# EAGLE design chlorophyll_analyzer_attachment (EAGLE 9.4.2)
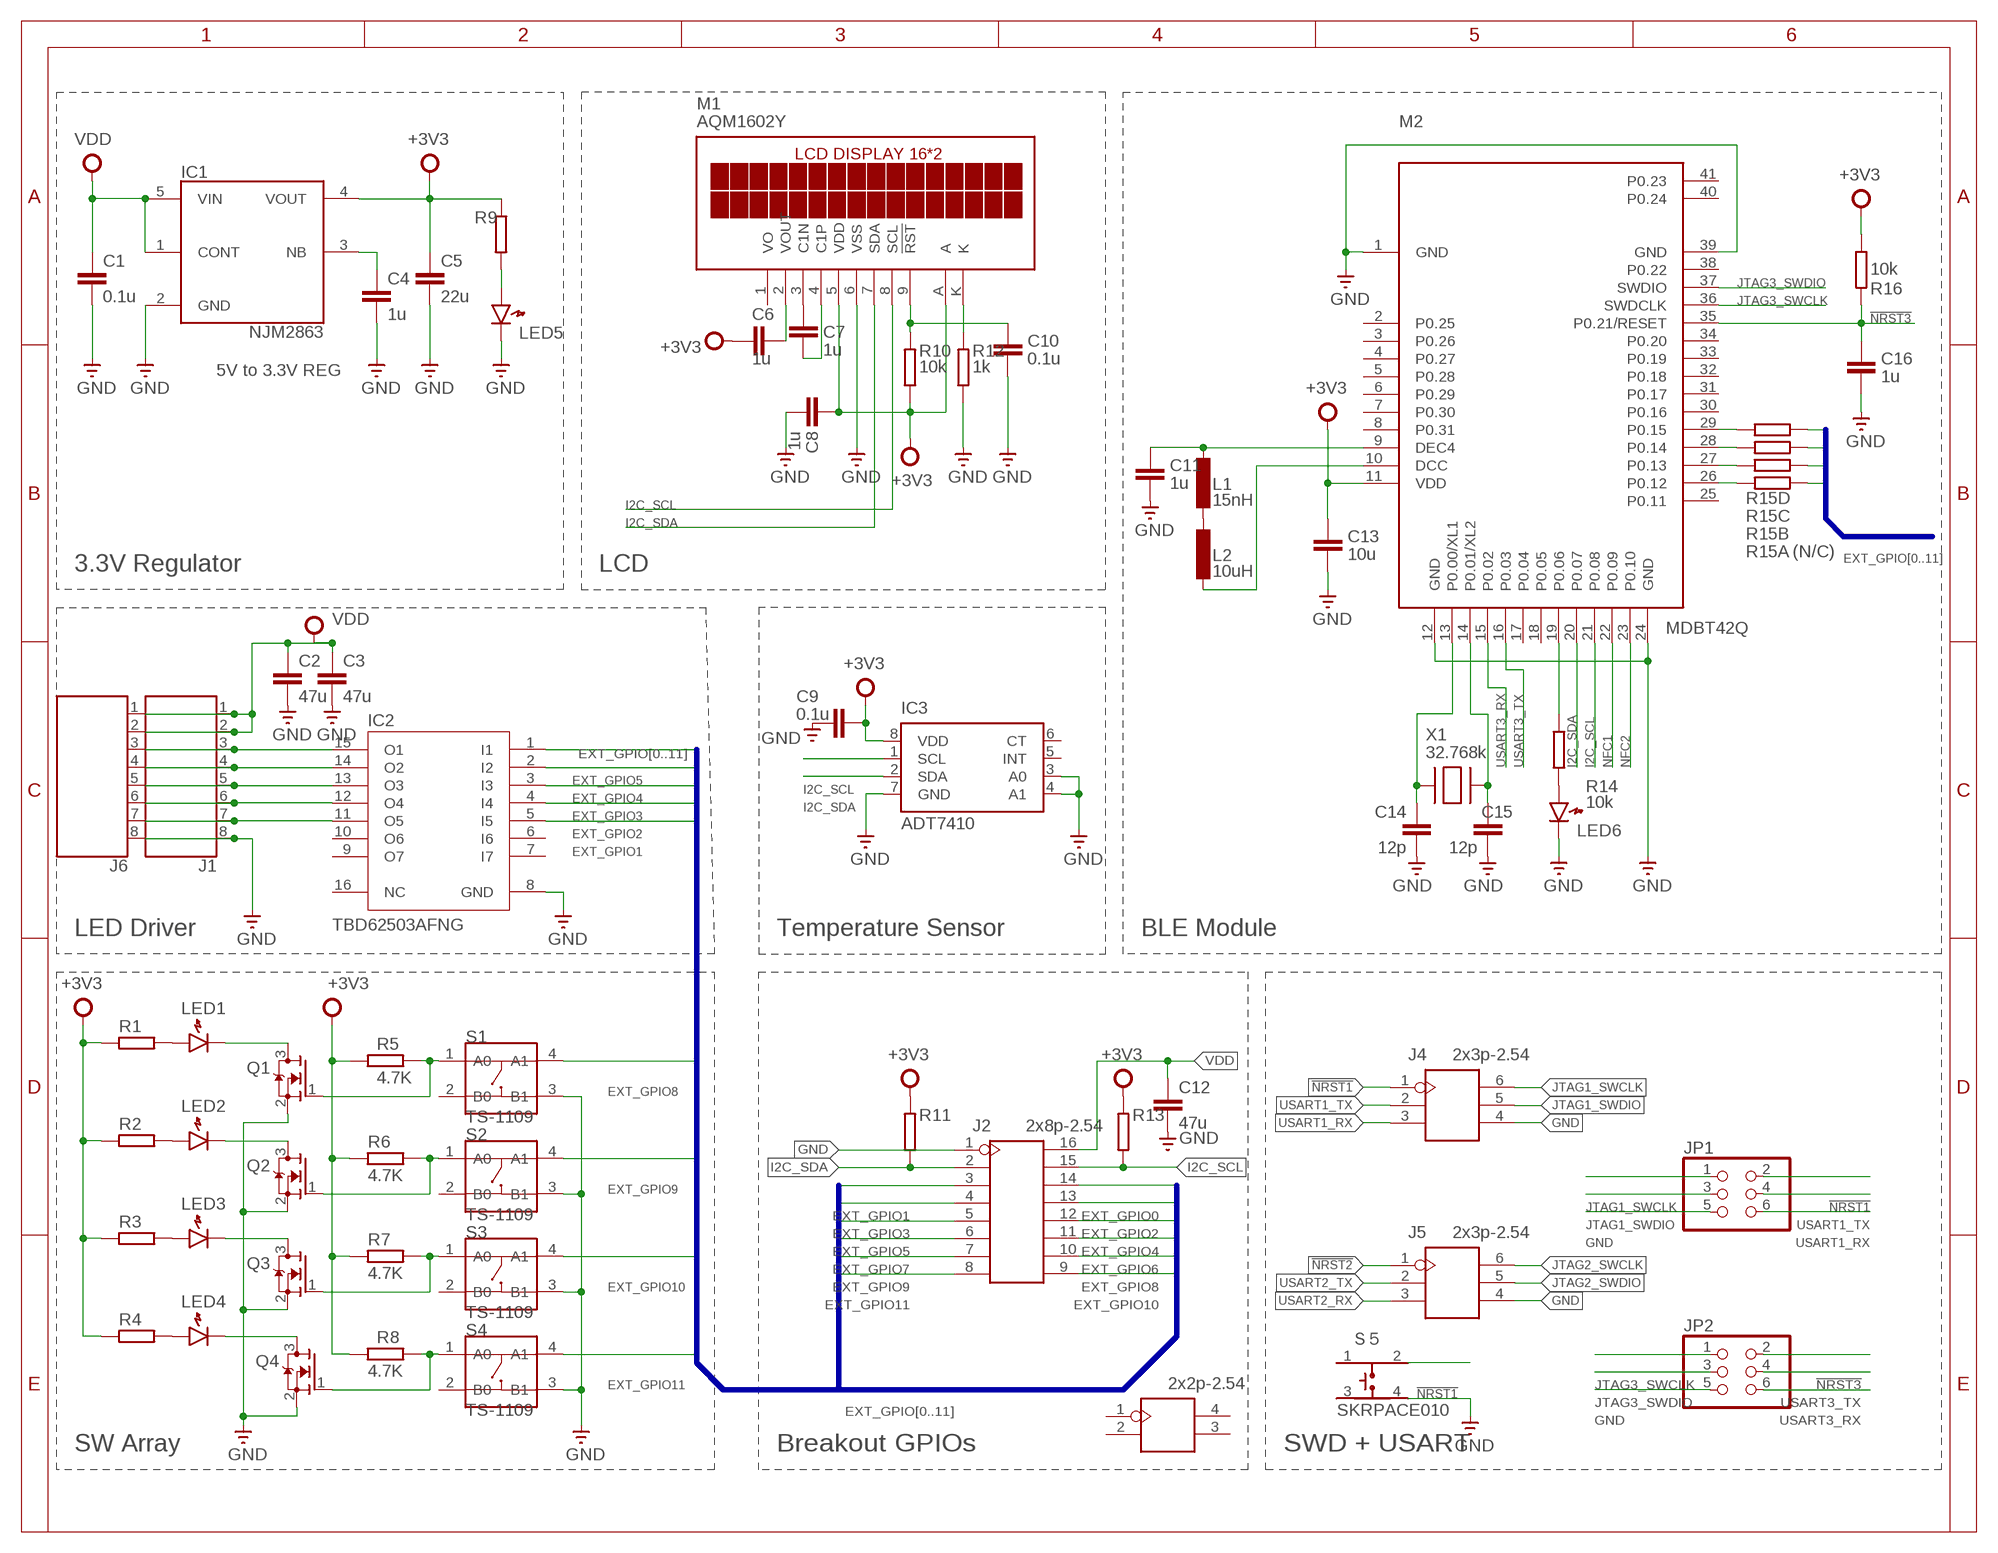
[diagram p0: schematic, sheet 1]

## Parts
C1  0.1u  C-EUC0603K  [C0603K]
C2  47u  C-EUC1206  [C1206]
C3  47u  C-EUC1206  [C1206]
C4  1u  C-EUC0603K  [C0603K]
C5  22u  C-EUC0603K  [C0603K]
C6  1u  C-EUC0603K  [C0603K]
C7  1u  C-EUC0603K  [C0603K]
C8  1u  C-EUC0603K  [C0603K]
C9  0.1u  C-EUC0603K  [C0603K]
C10  0.1u  C-EUC0603K  [C0603K]
C11  1u  C-EUC0603K  [C0603K]
C12  47u  C-EUC1206  [C1206]
C13  10u  C-EUC0603K  [C0603K]
C14  12p  C-EUC0603K  [C0603K]
C15  12p  C-EUC0603K  [C0603K]
C16  1u  C-EUC0603K  [C0603K]
IC1  NJM2863  [SOT-23-5]
IC2  TBD62503AFNG  [SSOP16-P-225-0.65B]
IC3  ADT7410  [SOIC8]
J1  687108183722  [687108183722]
J2  2x8p-2.54  DIP-BLACK-FEMALE-HEADER-VERT(2X8P-2.54)  [H2X8-2.54]
J3  2x2p-2.54  DIP-BLACK-FEMALE-HEADER-VERT(2X2P-2.54)  [H2X2-2.54]
J4  2x3p-2.54  DIP-BLACK-FEMALE-HEADER-VERT(2X3P-2.54)  [H2X3-2.54]
J5  2x3p-2.54  DIP-BLACK-FEMALE-HEADER-VERT(2X3P-2.54)  [H2X3-2.54]
J6  687108183722  [687108183722]
JP1  PINHD-2X3  [2X03]
JP2  PINHD-2X3  [2X03]
L1  15nH  INDUCOR1608  [SMD1608]
L2  10uH  INDUCOR1608  [SMD1608]
LED1  LED1608  [LED1608]
LED2  LED1608  [LED1608]
LED3  LED1608  [LED1608]
LED4  LED1608  [LED1608]
LED5  LED1608  [LED1608]
LED6  LED1608  [LED1608]
M1  AQM1602Y  [AQM1602Y]
M2  MDBT42Q  [MDBT42Q]
Q1  MOSFET-NREFLOW  [SOT23]
Q2  MOSFET-NREFLOW  [SOT23]
Q3  MOSFET-NREFLOW  [SOT23]
Q4  MOSFET-NREFLOW  [SOT23]
R1  RESISTOR1608  [SMD1608]
R2  RESISTOR1608  [SMD1608]
R3  RESISTOR1608  [SMD1608]
R4  RESISTOR1608  [SMD1608]
R5  4.7K  RESISTOR1608  [SMD1608]
R6  4.7K  RESISTOR1608  [SMD1608]
R7  4.7K  RESISTOR1608  [SMD1608]
R8  4.7K  RESISTOR1608  [SMD1608]
R9  RESISTOR1608  [SMD1608]
R10  10k  RESISTOR1608  [SMD1608]
R11  RESISTOR1608  [SMD1608]
R12  1k  RESISTOR1608  [SMD1608]
R13  RESISTOR1608  [SMD1608]
R14  10k  RESISTOR1608  [SMD1608]
R15  (N/C)  RESISTOR_ARRY1206  [RESCAXS80P320X160X60-8N]
R16  10k  RESISTOR1608  [SMD1608]
S1  TS-1109  DIP-BUTTON-4P  [SW4-6.0X6.0X5.0MM]
S2  TS-1109  DIP-BUTTON-4P  [SW4-6.0X6.0X5.0MM]
S3  TS-1109  DIP-BUTTON-4P  [SW4-6.0X6.0X5.0MM]
S4  TS-1109  DIP-BUTTON-4P  [SW4-6.0X6.0X5.0MM]
S５  SKRPACE010  [SW_SKRPACE010]
X1  32.768k  XTAL-3.2X1.5  [XTAL3215]

## Nets
!NRST1: J4.1 JP1.2 S５.2
!NRST2: J5.1
!NRST3: C16.1 JP2.2 M2.35(P0.21/RESET) R16.1
+3V3: C5.1 C6.1 C8.2 C9.1 C13.1 IC1.4(VOUT) IC3.8(VDD) M1.5(VDD) M1.A M2.11(VDD) R1.1 R2.1 R3.1 R4.1 R5.1 R6.1 R7.1 R8.1 R9.1 R10.2 R11.1 R13.1 R16.2
EXT_GPIO0: J2.14
EXT_GPIO1: IC2.5(I5) J2.3
EXT_GPIO2: IC2.4(I4) J2.13
EXT_GPIO3: IC2.3(I3) J2.4
EXT_GPIO4: IC2.2(I2) J2.12
EXT_GPIO5: IC2.1(I1) J2.5
EXT_GPIO6: J2.11
EXT_GPIO7: J2.6
EXT_GPIO8: J2.10 R15.8 S1.4(A1)
EXT_GPIO9: J2.7 R15.7 S2.4(A1)
EXT_GPIO10: J2.9 R15.6 S3.4(A1)
EXT_GPIO11: J2.8 R15.5 S4.4(A1)
GND: C1.2 C2.2 C3.2 C4.2 C5.2 C8.1 C9.2 C10.2 C11.2 C12.2 C13.2 C14.2 C15.2 C16.2 IC1.2(GND) IC2.8(GND) IC3.3(A0) IC3.4(A1) IC3.7(GND) J1.8 J2.1 J4.4 J5.4 J6.8 JP1.5 JP2.5 LED5.K LED6.K M1.6(VSS) M2.1(GND) M2.12(GND) M2.24(GND) M2.39(GND) Q1.2(S) Q2.2(S) Q3.2(S) Q4.2(S) R12.2 S1.3(B1) S2.3(B1) S3.3(B1) S4.3(B1) S５.4
I2C_SCL: IC3.1(SCL) J2.15 M1.8(SCL) M2.21(P0.08) R13.2
I2C_SDA: IC3.2(SDA) J2.2 M1.7(SDA) M2.20(P0.07) R11.2
JTAG1_SWCLK: J4.6 JP1.1
JTAG1_SWDIO: J4.5 JP1.3
JTAG2_SWCLK: J5.6
JTAG2_SWDIO: J5.5
JTAG3_SWCLK: JP2.1 M2.36(SWDCLK)
JTAG3_SWDIO: JP2.3 M2.37(SWDIO)
N$1: C6.2 M1.2(VOUT)
N$2: C7.2 M1.3(C1N)
N$3: C7.1 M1.4(C1P)
N$4: C4.1 IC1.3(NB)
N$5: LED5.A R9.2
N$6: C10.1 M1.9(!RST) R10.1
N$7: M1.K R12.1
N$8: Q1.1(G) R5.2 S1.1(A0)
N$9: Q2.1(G) R6.2 S2.1(A0)
N$10: Q3.1(G) R7.2 S3.1(A0)
N$11: Q4.1(G) R8.2 S4.1(A0)
N$12: L2.2 M2.10(DCC)
N$13: M2.19(P0.06) R14.2
N$14: C11.1 L1.1 M2.9(DEC4)
N$15: LED6.A R14.1
N$16: LED1.A R1.2
N$17: LED2.A R2.2
N$18: LED3.A R3.2
N$19: LED4.A R4.2
N$20: LED4.K Q4.3(D)
N$21: LED3.K Q3.3(D)
N$22: LED2.K Q2.3(D)
N$23: LED1.K Q1.3(D)
N$24: C14.1 M2.13(P0.00/XL1) X1.P$1
N$25: L1.2 L2.1
N$26: C15.1 M2.14(P0.01/XL2) X1.P$2
N$27: M2.26(P0.12) R15.1
N$28: M2.27(P0.13) R15.2
N$29: M2.28(P0.14) R15.3
N$30: M2.29(P0.15) R15.4
N$31: IC2.15(O1) J1.3 J6.3
N$32: IC2.14(O2) J1.4 J6.4
N$33: IC2.13(O3) J1.5 J6.5
N$34: IC2.12(O4) J1.6 J6.6
N$35: IC2.11(O5) J1.7 J6.7
NFC1: M2.22(P0.09)
NFC2: M2.23(P0.10)
USART1_RX: J4.3 JP1.6
USART1_TX: J4.2 JP1.4
USART2_RX: J5.3
USART2_TX: J5.2
USART3_RX: JP2.6 M2.15(P0.02)
USART3_TX: JP2.4 M2.16(P0.03)
VDD: C1.1 C2.1 C3.1 C12.1 IC1.1(CONT) IC1.5(VIN) J1.1 J1.2 J2.16 J6.1 J6.2
Unconnected: IC2.6(I6) IC2.7(I7) IC2.9(O7) IC2.10(O6) IC2.16(NC) IC3.5(INT) IC3.6(CT) J3.1 J3.2 J3.3 J3.4 M1.1(VO) M2.2(P0.25) M2.3(P0.26) M2.4(P0.27) M2.5(P0.28) M2.6(P0.29) M2.7(P0.30) M2.8(P0.31) M2.17(P0.04) M2.18(P0.05) M2.25(P0.11) M2.30(P0.16) M2.31(P0.17) M2.32(P0.18) M2.33(P0.19) M2.34(P0.20) M2.38(P0.22) M2.40(P0.24) M2.41(P0.23) S1.2(B0) S2.2(B0) S3.2(B0) S4.2(B0) S５.1 S５.3

## Buses
EXT_GPIO[0..11]

## Notes on the sheet
- 5V to 3.3V REG
- 3.3V Regulator | LCD
- LED Driver | Temperature Sensor | BLE Module
- SW Array | Breakout GPIOs | SWD + USART

## Library data of the parts
C1-C16 = rcl:C-EU: CAPACITOR, European symbol; SPICEPREFIX: C
IC1 = Fugu_LSI:NJM2863: Low Noize Low Drop Out Voltage Regulator
IC2 = TBD62503A:TBD62503A: 7ch Type-Sink DMOS Transistor Array
IC3 = ADT7410:ADT7410: ADT7410 - 13-bit 0.5°C I2C Temperature Sensor Operating Voltage: 2.7-5.5V Temperature Range: -55°C-150°C Accuracy: 0.5°C from -40°C-105°C Shutdown Current: 2uA (3.3V) Typical Operating Current (1 Sample/s): 46uA (3.3V) Digikey: ADT7410TRZ-ND; DESCRIPTION: ADI 0.5'C Accurate Temp Sensor-I2C Interface; DIGI-KEY_PART_NUMBER: ADT7410TRZ-REEL7CT-ND; DIGI-KEY_PURCHASE_URL: https://www.digikey.jp/product-detail/en/analog-devices-inc/ADT7410TRZ-REEL7/ADT7410TRZ-REEL7CT-ND/3674809?utm_source=snapeda&utm_medium=aggregator&utm_campaign=symbol; MF: Analog Devices; MP: ADT7410; PACKAGE: SOIC-8 Analog Devices
J1 J6 = Eagle_FPC_CONNECTOR_AND_FFC_CAB (rev18c):687108183722: 687108183722 WR-FPC 0.50mm SMT Horizontal Bottom Contact - Low Profile <http://katalog.we-online.de/media/images/v2/Family_WR-FPC_6871xx183722.jpg> Details see: http://katalog.we-online.de/en/em/FPC_0_5_SMT_ZIF_HORIZONTAL_BOTTOM_CONTACT_LOW_PROFILE_6871xx183722 Created by Yingchun,shan 2016 (C) Wurth Elektronik
J2 = Seeed-OPL-Connector:DIP-BLACK-FEMALE-HEADER-VERT(2X8P-2.54): 320030080; MPN: F185-1216A0BSYA1
J3 = Seeed-OPL-Connector:DIP-BLACK-FEMALE-HEADER-VERT(2X2P-2.54)
J4 J5 = Seeed-OPL-Connector:DIP-BLACK-FEMALE-HEADER-VERT(2X3P-2.54): 320030011; MPN: F185-1203A1BSYA1
JP1 JP2 = pinhead:PINHD-2X3: PIN HEADER
L1 L2 = Fugu_RCL:INDUCOR
LED1-LED6 = Fugu_RCL:LED: Generic LEDs
M1 = FUGU:AQM1602Y: SPECIFICATIONS FOR LIQUID CRYSTAL DISPLAY
M2 = MDBT42Q_171016:MDBT42Q: Raytac Corporation MDBT42Q-512K, MDBT42Q-P512K Bluetooth Low Energy Module based on Noridc nRF52832 Source: Raytac datasheet
Q1-Q4 = adafruit:MOSFET-N: N-Channel Mosfet 2N7002E - 60V 260mA SOT23 [Digikey: 2N7002ET1GOSTR-ND] - REEL BSH103 - 30V 850mA SOT23 [Digikey: 568-5013-1-ND]
R1-R14 R16 = Fugu_RCL:RESISTOR: Generic Registor
R15 = Fugu_RCL:RESISTOR_ARRY
S1-S4 = Seeed-OPL-Button:DIP-BUTTON-4P: 311020024; MPN: TS-1109; SPICEPREFIX: K
S５ = SKRPACE010:SKRPACE010: Switch Tactile N.O. SPST Button J-Bend 0.05A 16VDC 2.55N SMD Automotive T/R; AVAILABILITY: Unavailable; DESCRIPTION: Switch Tactile N.O. SPST Button J-Bend 0.05A 16VDC 2.55N SMD Automotive T/R; MF: ALPS; MP: SKRPACE010; PACKAGE: None; PRICE: None; SPICEPREFIX: S
X1 = adafruit:XTAL: Low cost SMT crystals, no capacitors included http://www.ladyada.net/library/eagle; SPICEPREFIX: X

## Board
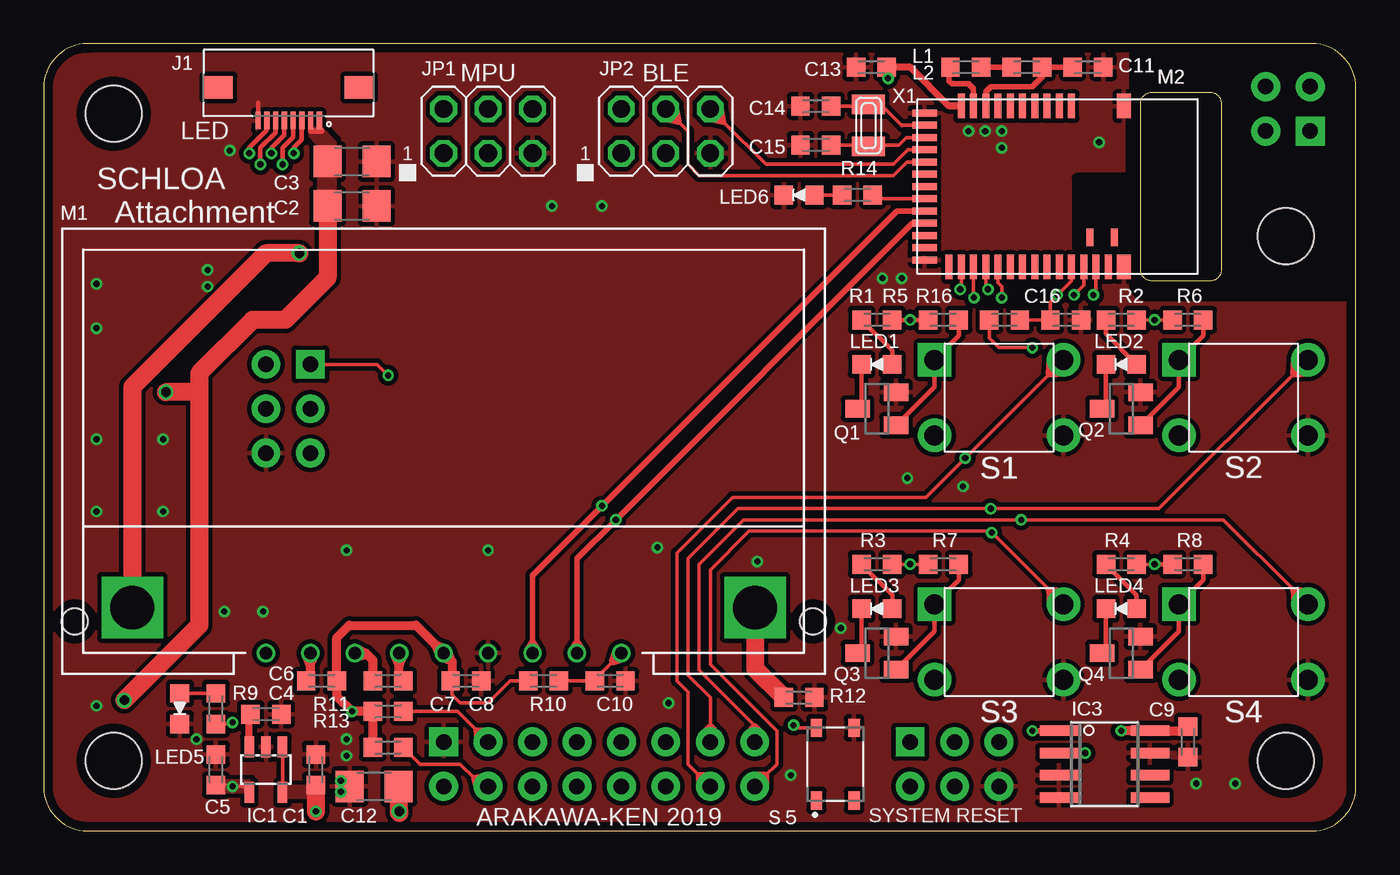
[diagram p1: board, top side]
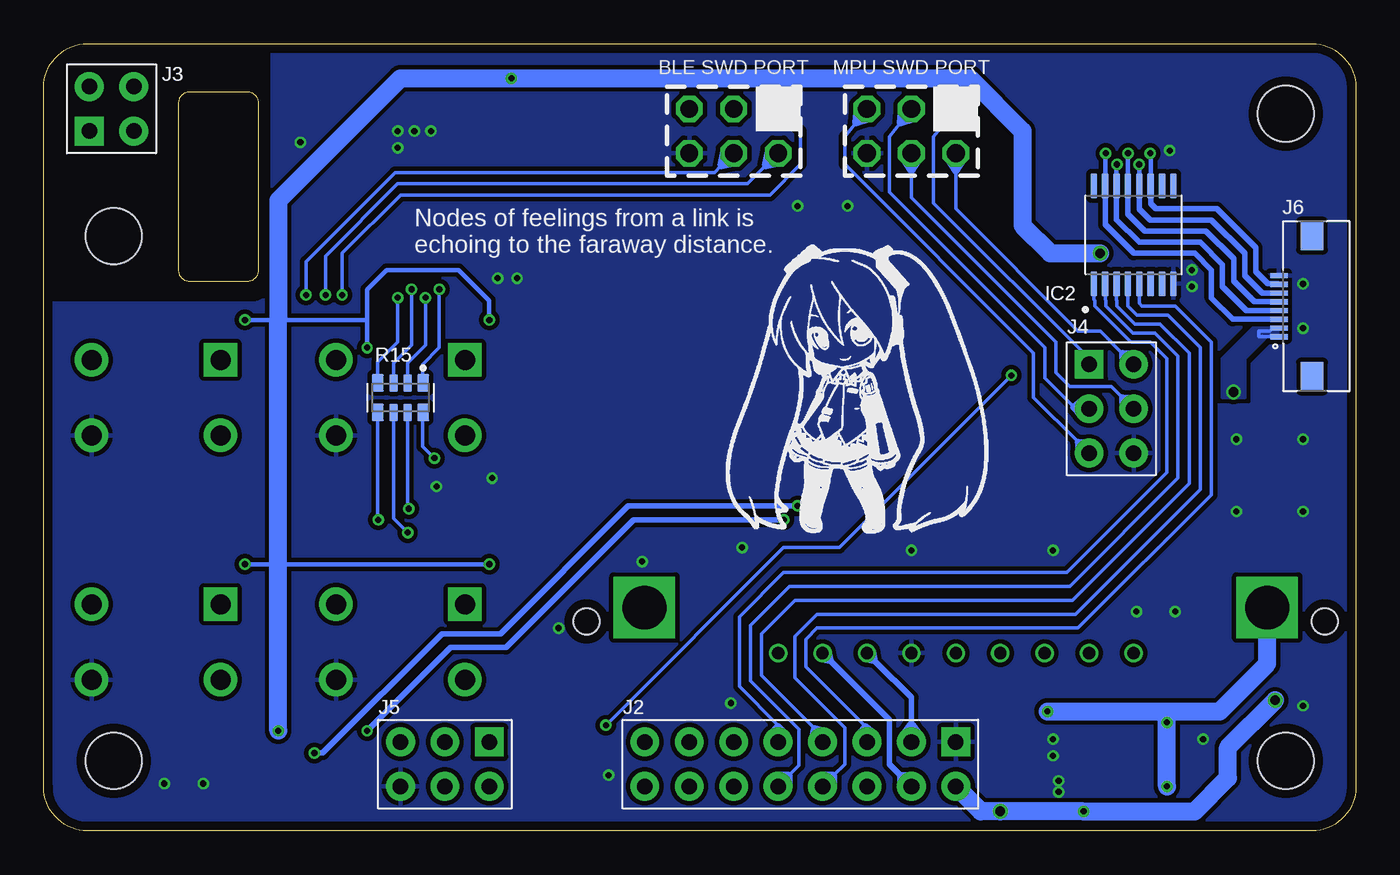
[diagram p2: board, bottom side, seen from below]

Size 75 x 45 mm. Coordinates in mm from the lower left corner, seen from the top.
Outline: 0,42.5 0,2.5 arc90 2.5,0 3.49,0 3.81,0 13.65,0 14.29,0 72.5,0 arc90 75,2.5 75,42.5 arc90 72.5,45 2.5,45 arc90 0,42.5
Outline: 67.31,41.59 67.31,32.07 arc-90 66.67,31.43 63.34,31.43 arc-90 62.71,32.07 62.71,41.59 arc-90 63.34,42.23 66.67,42.23 arc-90 67.31,41.59
Copper layers (1*16): Top 0.035mm / dielectric 1.6mm / Bottom 0.035mm
Design rules "Elecrow_2-layer_PCB_eagle_rule": minimum track width 6mil, minimum drill 12mil, track to track 6mil, track to pad 6mil, pad to pad 6mil, via to via 8mil, smd to smd 0mil, copper to edge 20mil, drill to drill 10mil, minimum pad ring 6mil, minimum via ring 6mil, stop-mask expansion 0mil, vias tented up to drill 100mil, thermal gap 10mil
Holes 3.2 mm at 4,4 4,41 71,34 71,4
tRestrict: 8 lines
bRestrict: 8 lines

### Footprints (pad centres in the part's own frame; a part is rotated, then mirrored left to right if it is on the bottom)
C0603K = smd 1.05 x 1.08: 1 -0.875,0; 2 0.875,0
C1206 = smd 1.6 x 1.8: 1 -1.4,0; 2 1.4,0
SOT-23-5 = smd 0.55 x 1.2: 1 -0.95,-1.3; 2 0,-1.3; 3 0.95,-1.3; 4 0.95,1.3; 5 -0.95,1.3
SSOP16-P-225-0.65B = smd 1.45 x 0.4: 1 -2.7,2.275; 2 -2.7,1.625; 3 -2.7,0.975; 4 -2.7,0.325; 5 -2.7,-0.325; 6 -2.7,-0.975; 7 -2.7,-1.625; 8 -2.7,-2.275; 9 2.9,-2.275; 10 2.9,-1.625; 11 2.9,-0.975; 12 2.9,-0.325; 13 2.9,0.325; 14 2.9,0.975; 15 2.9,1.625; 16 2.9,2.275
SOIC8 = smd 0.6 x 2.2: 1 -1.905,-2.6; 2 -0.635,-2.6; 3 0.635,-2.6; 4 1.905,-2.6; 5 1.905,2.6; 6 0.635,2.6; 7 -0.635,2.6; 8 -1.905,2.6
687108183722 = smd 0.3 x 1: 1 -1.75,1.9; 2 -1.25,1.9; 3 -0.75,1.9; 4 -0.25,1.9; 5 0.25,1.9; 6 0.75,1.9; 7 1.25,1.9; 8 1.75,1.9 | smd 1.65 x 1.3: Z1 -4.025,0; Z2 4.025,0
H2X8-2.54 = drill 0.889 pad 1.651 square: 1 -1.27,8.89 | drill 0.889 pad 1.651: 2 -1.27,6.35; 3 -1.27,3.81; 4 -1.27,1.27; 5 -1.27,-1.27; 6 -1.27,-3.81; 7 -1.27,-6.35; 8 -1.27,-8.89; 9 1.27,-8.89; 10 1.27,-6.35; 11 1.27,-3.81; 12 1.27,-1.27; 13 1.27,1.27; 14 1.27,3.81; 15 1.27,6.35; 16 1.27,8.89
H2X2-2.54 = drill 0.889 pad 1.651 square: 1 -1.27,1.27 | drill 0.889 pad 1.651: 2 -1.27,-1.27; 3 1.27,-1.27; 4 1.27,1.27
H2X3-2.54 = drill 0.889 pad 1.651 square: 1 -1.27,2.54 | drill 0.889 pad 1.651: 2 -1.27,0; 3 -1.27,-2.54; 4 1.27,-2.54; 5 1.27,0; 6 1.27,2.54
2X03 = drill 1.016 octagon: 1 -2.54,-1.27; 2 -2.54,1.27; 3 0,-1.27; 4 0,1.27; 5 2.54,-1.27; 6 2.54,1.27
SMD1608 = smd 1.05 x 1.08: 1 -0.875,0; 2 0.875,0
LED1608 = smd 1.05 x 1.08: A -0.875,0; K 0.875,0
AQM1602Y = drill 0.7: 1 -10.16,0; 2 -7.62,0; 3 -5.08,0; 4 -2.54,0; 5 0,0; 6 2.54,0; 7 5.08,0; 8 7.62,0; 9 10.16,0 | drill 2.5 square: A -17.8,2.6; K 17.8,2.6 | hole 1.5: 21.1,1.8; -21.1,1.8
MDBT42Q = smd 1.4 x 0.8: 1 -4.6,3.8; 39 4.6,3.8 | smd 1.4 x 0.4: 2 -4.6,0.8; 3 -4.6,0.1; 4 -4.6,-0.6; 5 -4.6,-1.3; 6 -4.6,-2; 7 -4.6,-2.7; 8 -4.6,-3.4; 9 -4.6,-4.1; 10 -4.6,-4.8; 11 -4.6,-5.5; 25 4.6,-6.2; 26 4.6,-5.5; 27 4.6,-4.8; 28 4.6,-4.1; 29 4.6,-3.4; 30 4.6,-2.7; 31 4.6,-2; 32 4.6,-1.3; 33 4.6,-0.6; 34 4.6,0.1; 35 4.6,0.8; 36 4.6,1.5; 37 4.6,2.2; 38 4.6,2.9 | smd 0.4 x 1.4: 12 -4.2,-7.6; 13 -3.5,-7.6; 14 -2.8,-7.6; 15 -2.1,-7.6; 16 -1.4,-7.6; 17 -0.7,-7.6; 18 0,-7.6; 19 0.7,-7.6; 20 1.4,-7.6; 21 2.1,-7.6; 22 2.8,-7.6; 23 3.5,-7.6; 24 4.2,-7.6 | smd 1 x 0.4: 40 2.9,3.25; 41 2.9,1.85
SOT23 = smd 1 x 1.4: 1 -0.95,-1.1; 2 0.95,-1.1; 3 0,1.1
RESCAXS80P320X160X60-8N = smd 0.98 x 0.68: 1 -0.845,1.3; 4 -0.845,-1.3; 5 0.845,-1.3; 8 0.845,1.3 | smd 0.98 x 0.48: 2 -0.845,0.4; 3 -0.845,-0.4; 6 0.845,-0.4; 7 0.845,0.4
SW4-6.0X6.0X5.0MM = drill 1.143 pad 1.905 square: 1 -3.683,2.159 | drill 1.143 pad 1.905: 2 -3.683,-2.159; 3 3.683,-2.159; 4 3.683,2.159
SW_SKRPACE010 = smd 1.05 x 0.65: 1 -2.075,1.075; 2 2.075,1.075; 3 -2.075,-1.075; 4 2.075,-1.075
XTAL3215 = smd 1.1 x 1.9: P$1 1.2,0; P$2 -1.2,0

### Placement (x,y rotation side)
C1  15.56,3.49 90 top
C2  17.62,35.72 0 top
C3  17.62,38.26 0 top
C4  12.7,6.67 0 top
C5  9.84,3.49 90 top
C6  15.88,8.57 180 top
C7  19.68,8.57 180 top
C8  24.13,8.57 180 top
C9  65.41,5.08 270 top
C10  32.38,8.57 0 top
C11  59.69,43.66 0 top
C12  18.89,2.54 180 top
C13  47.31,43.66 180 top
C14  44.13,41.43 180 top
C15  44.13,39.21 180 top
C16  58.42,29.21 0 top
IC1  12.7,3.49 180 top
IC2  12.7,33.97 90 bottom
IC3  60.64,3.81 270 top
J1  14,42.5 180 top
J2  31.75,3.81 270 bottom
J3  71.12,41.27 90 bottom
J4  13.97,24.13 0 bottom
J5  52.07,3.81 270 bottom
J6  2.5,30 90 bottom
JP1  25.4,40.01 0 top
JP2  35.56,40.01 0 top
L1  56.2,43.66 180 top
L2  52.7,43.66 180 top
LED1  47.62,26.67 180 top
LED2  61.59,26.67 180 top
LED3  47.62,12.7 180 top
LED4  61.59,12.7 180 top
LED5  7.78,6.99 270 top
LED6  43.18,36.35 180 top
M1  22.86,10.16 0 top
M2  57.94,36.83 270 top
Q1  47.62,24.13 90 top
Q2  61.59,24.13 90 top
Q3  47.62,10.16 90 top
Q4  61.59,10.16 90 top
R1  47.62,29.21 180 top
R2  61.59,29.21 180 top
R3  47.62,15.24 180 top
R4  61.59,15.24 180 top
R5  51.44,29.21 0 top
R6  65.41,29.21 0 top
R7  51.44,15.24 0 top
R8  65.41,15.24 0 top
R9  9.84,6.99 90 top
R10  28.57,8.57 180 top
R11  19.68,6.83 0 top
R12  43.18,7.62 0 top
R13  19.68,4.76 0 top
R14  46.51,36.35 0 top
R15  54.61,24.77 270 bottom
R16  54.93,29.21 180 top
S1  54.61,24.77 0 top
S2  68.58,24.77 0 top
S3  54.61,10.79 0 top
S4  68.58,10.79 0 top
S５  45.24,3.81 90 top
X1  47.15,40.32 90 top

### Tracks (layer width: path | path; a pad name or v marks a point on that pad's centre or on a via)
!NRST1  (via drill 0.35)
  Top 0.203: S５.2 43.01,5.88 v42.86,6.03 | v19.68,26.04 19.05,26.67 J4.1
  Bottom 0.203: JP1.2 23.5,40.48 24.13,39.69 24.13,35.88 15.24,26.99 J4.1 | v42.86,6.03 32.7,16.19 29.53,16.19 v19.68,26.04
  Bottom 0.406: 23.5,40.48 23.42,41.33 JP1.2 22.69,40.74 23.5,40.48
!NRST3  (via drill 0.35)
  Top 0.203: M2.35 58.74,31.44 v57.94,30.64 57.55,30.24 C16.1 R16.1
  Bottom 0.203: JP2.2 32.3,40.56 31.75,40.01 31.75,38.1 33.5,36.35 54.61,36.35 57.94,33.02 v57.94,30.64
  Bottom 0.406: 32.3,40.56 33.13,40.73 JP2.2 32.47,41.39 32.3,40.56
+3V3  (via drill 0.35, 0.55)
  Top 0.152: C5.1 10.72,2.62 v10.79,2.54
  Top 0.203: R3.1 v49.53,15.24 R7.1 | R6.1 v63.5,29.21 R2.1 | v63.5,15.24 R4.1 | v10.79,2.54 11.4,2.54 IC1.4 | R10.2 26.67,8.57 25.4,7.3 23.81,7.3 23.36,7.76 23.36,8.67 | R16.2 54.05,28.18 54.61,27.62 v56.52,27.62 | v10.79,6.19 10.71,6.11 R9.1
  Top 0.254: R1.1 v49.53,29.21 R5.1 | R8.1 v63.5,15.24
  Top 0.406: M2.11 51.76,41.43 49.53,43.66 C13.1
  Top 0.508: R13.1 R11.1 v17.62,6.83 16.75,7.7 C6.1 16.75,11.04 17.46,11.75 21.27,11.75 22.36,10.65 | 22.36,10.65 M1.5 | 23.36,9.66 M1.5 | C9.1 65.17,5.71 IC3.8 v61.59,5.71 | 23.36,9.66 23.36,8.67 C8.2 | 22.36,10.65 22.61,10.06 M1.5 | 22.36,10.65 22.96,10.41 M1.5 | 23.36,9.66 23.11,10.26 M1.5 | 23.36,9.66 22.76,9.91 M1.5
  Top 0.61: C13.1 48.26,43.58 v48.26,43.02
  Top 1.016: v14.61,33.02 12.7,33.02 5.06,25.38 M1.A
  Bottom 0.203: v10.79,6.19 10.79,6.83
  Bottom 0.254: v49.53,15.24 61.59,15.24 v63.5,15.24 | v49.53,29.21 49.53,30.32 51.28,32.07 55.4,32.07 56.52,30.96 56.52,29.21 | v63.5,29.21 61.59,29.21 56.52,29.21 | 56.52,29.21 v56.52,27.62
  Bottom 1.016: v17.62,6.83 10.79,6.83 | 10.79,6.83 7.78,6.83 5.06,9.54 M1.A | v10.79,2.54 10.79,6.83 | v14.61,33.02 17.46,33.02 19.05,34.61 19.05,40.01 22.07,43.02 v48.26,43.02 54.61,43.02 61.59,36.04 61.59,29.21 61.59,15.24 v61.59,5.71
  pour Top (isolate 0.254, no thermals): 9.53,2.86 11.75,2.86 11.75,2.22 9.53,2.22
EXT_GPIO1
  Bottom 0.203: IC2.5 12.38,30.33 12.38,30.32 12.38,30.16 12.22,30 10.32,30 8.26,27.94 8.26,19.21 15.88,11.59 30.8,11.59 31.43,10.95 31.43,9.37 28.03,5.96 27.94,5.87 J2.3
  Bottom 0.406: 28.03,5.96 27.54,5.56 J2.3 28.43,5.47 28.03,5.96
EXT_GPIO2
  Bottom 0.203: IC2.4 13.03,30.33 13.02,30.32 13.02,30 12.5,29.49 10.76,29.49 8.89,27.62 8.89,19.53 16.03,12.38 30.8,12.38 32.07,11.11 32.07,8.73 29.21,5.87 29.21,3.81 29.85,3.17 J2.13
  Bottom 0.406: 29.85,3.17 29.86,2.53 J2.13 30.49,3.16 29.85,3.17
EXT_GPIO3
  Bottom 0.203: IC2.3 13.68,30.34 13.65,30.32 13.65,30 12.62,28.98 11.2,28.98 9.53,27.3 9.53,19.84 16.19,13.18 32.07,13.18 33.97,11.27 33.97,8.89 30.93,5.85 30.48,5.4 J2.4
  Bottom 0.406: 30.93,5.85 30.32,5.68 J2.4 31.08,5.23 30.93,5.85
EXT_GPIO4
  Bottom 0.203: IC2.2 14.32,30.36 14.29,30.32 14.29,30 12.74,28.46 11.47,28.46 10.16,27.15 10.16,20.16 16.35,13.97 32.38,13.97 34.61,11.75 34.61,8.57 31.83,5.79 31.83,3.73 32.39,3.17 J2.12
  Bottom 0.406: 32.39,3.17 32.4,2.53 J2.12 33.03,3.16 32.39,3.17
EXT_GPIO5
  Bottom 0.203: IC2.1 14.97,30.37 14.92,30.32 14.92,30 12.87,27.95 11.75,27.95 10.79,26.99 10.79,20.48 16.51,14.76 32.7,14.76 35.24,12.22 35.24,8.26 33.02,6.03 33.02,5.97 J2.5
  Bottom 0.406: 33.02,5.97 32.58,5.52 J2.5 33.46,5.52 33.02,5.97
EXT_GPIO8  (via drill 0.35)
  Top 0.203: S1.4 57.48,26.12 v52.67,21.3 50.42,19.05 39.37,19.05 36.2,15.88 36.2,8.57 36.83,7.94 36.83,3.81 37.47,3.17 J2.10
  Top 0.406: 37.47,3.17 37.48,2.53 J2.10 38.11,3.16 37.47,3.17 | 57.48,26.12 58.35,26.18 S1.4 57.55,26.98 57.48,26.12
  Bottom 0.203: v52.67,21.3 53.34,21.97 53.34,23.89 R15.8
EXT_GPIO9  (via drill 0.35)
  Top 0.203: S2.4 71.45,26.12 63.75,18.41 v54.13,18.41 39.69,18.41 36.83,15.56 36.83,8.89 38.1,7.62 38.1,5.97 J2.7
  Top 0.406: 38.1,5.97 37.66,5.52 J2.7 38.54,5.52 38.1,5.97 | 71.45,26.12 72.32,26.18 S2.4 71.52,26.98 71.45,26.12
  Bottom 0.203: R15.7 54.21,18.49 v54.13,18.41
EXT_GPIO10  (via drill 0.35)
  Top 0.203: S3.4 57.48,13.76 v54.2,17.05 54.1,17.14 40.32,17.14 38.1,14.92 38.1,9.53 41.91,5.71 41.91,3.81 41.27,3.17 J2.9
  Top 0.406: 41.27,3.17 40.63,3.16 J2.9 41.26,2.53 41.27,3.17 | 57.48,13.76 57.55,12.9 S3.4 58.35,13.7 57.48,13.76
  Bottom 0.203: R15.6 55.01,17.86 v54.2,17.05
EXT_GPIO11  (via drill 0.35)
  Top 0.203: S4.4 71.45,13.76 67.44,17.78 v55.88,17.78 40.01,17.78 37.47,15.24 37.47,9.21 40.64,6.03 40.64,5.97 J2.8
  Top 0.406: 40.64,5.97 40.2,5.52 J2.8 41.08,5.52 40.64,5.97 | 71.45,13.76 71.52,12.9 S4.4 72.32,13.7 71.45,13.76
  Bottom 0.203: R15.5 55.91,17.81 v55.88,17.78
GND  (via drill 0.35)
  Top 0.254: J1.8 12.25,41.62
  other vias: 25.4,16.03 60.33,39.37 52.86,40.01 53.82,40.01 54.77,40.01 54.77,39.05 17.3,16.03 35.08,16.19 3.02,28.73 49.37,20.16 45.56,11.59 35.72,7.3 40.8,15.4 52.55,19.68 42.7,3.17 17.3,5.24 17.3,4.29 16.99,2.86 16.99,2.22 65.88,2.7 68.1,2.7 49.05,31.59 47.94,31.59 29.05,35.72 31.91,35.72 10.64,38.89 6.83,22.38 6.83,18.26 3.02,22.38 3.02,18.26 3.02,31.27 12.54,12.54 10.32,12.54 3.02,7.14 8.73,5.24 9.37,32.07 9.37,31.11
  pour Top (isolate 0.254, rank 2): -2,47 77,47 77,-2 -2,-2
  pour Bottom (isolate 0.254, rank 2): -4,49 79,49 79,-4 -4,-4
I2C_SCL  (via drill 0.35)
  Top 0.203: J2.15 25.08,2.54 24.63,2.99 23.81,3.81 21.51,3.81 R13.2
  Top 0.305: IC3.1 v56.52,5.71 | M1.8 30.48,10.86 | 30.48,10.86 30.48,15.56 v32.7,17.78 49.65,34.73 M2.21 | 30.48,10.86 30.16,10.36 M1.8 | 30.48,10.86 30.8,10.36 M1.8
  Top 0.406: 24.63,2.99 24.8,2.38 J2.15 25.25,3.14 24.63,2.99
  Bottom 0.203: 26.03,3.17 J2.15
  Bottom 0.305: 26.03,3.17 26.67,3.81 26.67,6.35 29.98,9.66 | v56.52,5.71 51.75,10.48 48.58,10.48 41.27,17.78 v32.7,17.78 | 29.98,9.66 M1.8 | 29.98,9.66 30.56,9.8 M1.8 | 29.98,9.66 30.12,10.24 M1.8
  Bottom 0.406: 26.03,3.17 25.39,3.16 J2.15 26.02,2.53 26.03,3.17
I2C_SDA  (via drill 0.35)
  Top 0.203: R11.2 23.65,6.83 24.77,5.71 J2.2
  Top 0.305: IC3.2 v59.53,4.45 | M1.7 27.94,10.86 | 27.94,10.86 27.94,14.61 v31.91,18.57 48.77,35.43 M2.20 | 27.94,10.86 27.62,10.36 M1.7 | 27.94,10.86 28.25,10.36 M1.7
  Top 0.406: 24.77,5.71 24.78,5.07 J2.2 25.41,5.7 24.77,5.71
  Bottom 0.305: J2.2 25.4,5.97 25.4,7.62 27.45,9.66 | v59.53,4.45 59.05,4.45 52.23,11.27 48.9,11.27 41.59,18.57 v31.91,18.57 | 27.45,9.66 M1.7 | 27.45,9.66 28.02,9.8 M1.7 | 27.45,9.66 27.58,10.24 M1.7
  Bottom 0.61: 25.4,5.97 24.98,5.38 J2.2 25.82,5.38 25.4,5.97
JTAG1_SWCLK
  Bottom 0.203: JP1.1 22.86,37.72 22.86,35.56 15.88,28.57 14.61,28.57 13.33,27.3 J4.6
  Bottom 0.406: 13.33,27.3 12.69,27.29 J4.6 13.32,26.66 13.33,27.3 | 22.86,37.72 23.33,38.43 JP1.1 22.39,38.43 22.86,37.72
JTAG1_SWDIO
  Bottom 0.203: JP1.3 25.4,37.72 25.4,36.2 17.14,27.94 17.14,26.19 16.35,25.4 13.97,25.4 13.33,24.76 J4.5
  Bottom 0.406: 13.33,24.76 12.69,24.75 J4.5 13.32,24.12 13.33,24.76 | 25.4,37.72 25.87,38.43 JP1.3 24.93,38.43 25.4,37.72
JTAG3_SWCLK  (via drill 0.35)
  Top 0.203: M2.36 59.44,31.19 v58.9,30.64
  Bottom 0.203: v58.9,30.64 58.9,32.86 54.77,36.99 34.77,36.99 33.74,38.02 JP2.1
  Bottom 0.406: 33.74,38.02 33.57,38.85 JP2.1 32.91,38.19 33.74,38.02
JTAG3_SWDIO  (via drill 0.35)
  Top 0.203: M2.37 60.14,30.77 v60.01,30.64
  Bottom 0.203: v60.01,30.64 60.01,32.54 54.93,37.62 36.67,37.62 36.28,38.02 JP2.3
  Bottom 0.406: 36.28,38.02 36.11,38.85 JP2.3 35.45,38.19 36.28,38.02
N$1
  Top 0.508: M1.2 15.24,9.46 | 15.24,9.46 15.24,8.81 C6.2 | 15.24,9.46 15.49,10.05 M1.2 | 15.24,9.46 14.99,10.05 M1.2
N$2
  Top 0.508: M1.3 18.41,10.16 18.48,10.1 | 18.48,10.1 18.81,9.77 C7.2 | 18.48,10.1 17.91,10.4 M1.3 | 18.48,10.1 17.86,9.9 M1.3
N$3
  Top 0.508: 20.32,9.46 20.32,8.81 C7.1 | 20.32,9.46 M1.4 | 20.32,9.46 20.57,10.05 M1.4 | 20.32,9.46 20.07,10.05 M1.4
N$4
  Top 0.406: IC1.3 11.75,6.59 C4.1
N$5
  Top 0.203: LED5.A R9.2
N$6
  Top 0.203: R10.1 C10.1 31.51,8.65 32.52,9.66 M1.9
  Top 0.406: 32.52,9.66 33.12,9.85 M1.9 32.71,10.26 32.52,9.66
N$7
  Top 1.016: M1.K 40.66,9.27 R12.1
N$8
  Top 0.254: R5.2 52.31,28.31 S1.1 50.93,25.38 Q1.1
N$9
  Top 0.254: R6.2 66.28,28.31 S2.1 64.9,25.38 Q2.1
N$10
  Top 0.254: R7.2 52.31,14.34 S3.1 50.93,11.41 Q3.1
N$11
  Top 0.254: R8.2 66.28,14.34 S4.1 64.9,11.41 Q4.1
N$12
  Top 0.305: L2.2 51.75,43.58 51.75,42.86 51.91,42.7 52.86,42.7 53.14,42.42 M2.10
N$13
  Top 0.203: M2.19 47.61,36.13 R14.2
N$14
  Top 0.305: C11.1 L1.1 57.07,43.1 56.52,42.55 54.13,42.55 53.84,42.26 M2.9
N$15
  Top 0.203: R14.1 LED6.A
N$16
  Top 0.203: R1.2
  Top 0.254: LED1.A 48.5,27.46 R1.2
N$17
  Top 0.254: R2.2 60.72,28.42 LED2.A
N$18
  Top 0.254: LED3.A 48.5,13.49 R3.2
N$19
  Top 0.254: R4.2 62.47,13.49 LED4.A
N$20
  Top 0.203: Q4.3 60.72,10.38
  Top 0.254: 60.72,10.38 LED4.K
N$21
  Top 0.203: 46.75,10.38 Q3.3
  Top 0.254: LED3.K 46.75,10.38
N$22
  Top 0.203: 60.72,24.36 Q2.3
  Top 0.254: LED2.K 60.72,24.36
N$23
  Top 0.203: 46.75,24.36 Q1.3
  Top 0.254: LED1.K 46.75,24.36
N$24
  Top 0.203: 47.24,41.43 X1.P$1 | C14.1 47.24,41.43 | M2.13 49.06,40.33 49.05,40.32 47.94,41.43 47.24,41.43
N$25
  Top 0.305: L2.1 L1.2
N$26
  Top 0.203: C15.1 47.06,39.21 X1.P$2 47.24,39.21 48.9,39.21 49.31,39.63 M2.14
N$27  (via drill 0.35)
  Top 0.203: M2.26 52.44,31.12 52.44,31.01 v52.39,30.96
  Bottom 0.203: R15.1 53.34,25.64 53.34,26.67 52.39,27.62 v52.39,30.96
N$28  (via drill 0.35)
  Top 0.203: M2.27 53.14,30.52 v53.18,30.48
  Bottom 0.203: R15.2 54.21,26.75 53.18,27.78 v53.18,30.48
N$29  (via drill 0.35)
  Top 0.203: M2.28 53.84,30.82 v53.98,30.96
  Bottom 0.203: v53.98,30.96 53.98,27.78 55.01,26.75 R15.3
N$30  (via drill 0.35)
  Top 0.203: M2.29 54.54,31.34 54.77,31.11 v54.77,30.48
  Bottom 0.203: v54.77,30.48 54.77,27.94 55.91,26.8 R15.4
N$31  (via drill 0.35)
  Top 0.254: J1.3 14.75,39.52 14.29,39.05 v14.29,38.73
  Bottom 0.254: IC2.15 14.32,38.7 v14.29,38.73
  Bottom 0.305: J6.3 7.04,29.25 8.26,30.47 8.26,32.07 9.21,33.02 12.7,33.02 14.32,34.65 IC2.15
N$32  (via drill 0.35)
  Top 0.254: J1.4 14.25,39.65 13.65,39.05 v13.65,38.1
  Bottom 0.254: IC2.14 13.68,38.08 v13.65,38.1
  Bottom 0.305: IC2.14 13.68,34.95 12.38,33.66 8.89,33.66 7.62,32.38 7.62,31.11 6.25,29.75 J6.4
N$33  (via drill 0.35)
  Top 0.254: J1.5 13.75,39.78 13.02,39.05 v13.02,38.73
  Bottom 0.254: IC2.13 v13.03,38.73 v13.02,38.73
  Bottom 0.305: IC2.13 13.03,35.25 12.06,34.29 8.57,34.29 6.99,32.7 6.99,31.43 5.8,30.25 J6.5
N$34  (via drill 0.35)
  Top 0.254: J1.6 13.25,39.92 12.38,39.05 v12.38,38.1
  Bottom 0.254: IC2.12 12.38,37.79 v12.38,38.1
  Bottom 0.305: IC2.12 12.38,35.55 11.75,34.92 8.26,34.92 6.35,33.02 6.35,31.75 5.35,30.75 J6.6
N$35  (via drill 0.35)
  Top 0.254: 12.52,39.82 | J1.7 12.75,40.05 12.52,39.82 | v11.75,38.73 11.75,39.05 12.52,39.82
  Bottom 0.254: IC2.11 11.72,38.71 v11.75,38.73
  Bottom 0.305: IC2.11 11.72,35.85 11.43,35.56 7.94,35.56 5.71,33.34 5.71,31.98 5.03,31.3 4.45,31.3 J6.7
USART1_RX
  Bottom 0.203: J4.3 15.87,22.22 18.41,24.77 18.41,27.3 29.21,38.1 29.21,39.69 28.57,40.48 JP1.6
  Bottom 0.406: 15.87,22.22 15.23,22.21 J4.3 15.86,21.58 15.87,22.22 | 28.57,40.48 28.5,41.33 JP1.6 27.77,40.74 28.57,40.48
USART1_TX
  Bottom 0.203: JP1.4 26.04,40.48 26.67,39.69 26.67,36.51 17.78,27.62 17.78,25.88 16.12,24.22 16.03,24.13 J4.2
  Bottom 0.406: 16.12,24.22 15.63,24.62 J4.2 15.72,23.73 16.12,24.22 | 26.04,40.48 25.96,41.33 JP1.4 25.23,40.74 26.04,40.48
USART3_RX
  Top 0.203: JP2.6 38.82,40.56 41.27,38.1 48.58,38.1 49.41,38.93 M2.15
  Top 0.406: 38.82,40.56 38.65,41.39 JP2.6 37.99,40.73 38.82,40.56
USART3_TX
  Top 0.203: JP2.4 36.28,40.56 36.83,40.01 36.83,38.1 37.47,37.47 48.58,37.47 49.34,38.23 M2.16
  Top 0.406: 36.28,40.56 36.11,41.39 JP2.4 35.45,40.73 36.28,40.56
VDD  (via drill 0.35, 0.55)
  Top 0.203: IC1.1 IC1.5
  Top 0.305: J1.2 15.25,40.02 15.26,40.01 15.88,40.01 15.75,40.13 J1.1
  Top 1.016: v15.56,1.11 C1.1 | 8.89,25.08 8.89,26.16 11.94,29.21 13.81,29.21 16.22,31.62 C2.1 | 8.89,25.08 8.89,11.75 v4.6,7.46 | C12.1 20.29,1.04 20.32,1.02 v20.32,1.11 | 8.89,25.08 v6.99,25.08
  Bottom 0.203: J6.2 4.75,28.75 4.92,28.57 5.56,28.57 5.56,28.26 5.55,28.25 J6.1
  Bottom 1.016: J2.16 21.43,1.11 v20.32,1.11 v15.56,1.11 9.21,1.11 7.3,3.02 7.3,4.76 v4.6,7.46
  pour Top (isolate 0.254, no thermals): 13.65,2.54 15.88,2.54 15.88,1.91 13.65,1.91
  pour Top (isolate 0.254, no thermals): 15.08,40.16 15.88,40.16 16.67,39.37 16.67,34.92 15.72,34.92 15.72,39.21 15.08,39.85
  pour Bottom (isolate 0.254, no thermals): 4.45,28.73 5.87,28.73 7.62,26.99 7.62,24.77 6.35,24.77 6.35,26.99 5.08,28.26 4.45,28.26

### Text on the board
tPlace: MPU | BLE | LED | 1 | 1 | SCHLOA / Attachment | ARAKAWA-KEN 2019 | SYSTEM RESET
bPlace: MPU SWD PORT | BLE SWD PORT | Nodes of feelings from a link is / echoing to the faraway distance.
_tNames: C13 | L1 | J1 | JP1 | JP2 | L2 | C11 | M2 | C14 | X1 | C15 | C3 | LED6 | R14 | C2 | M1 | R1 | R5 | R16 | C16 | R2 | R6 | LED1 | LED2 | Q1 | Q2 | S1 | S2 | R3 | R7 | R4 | R8 | LED3 | LED4 | C6 | Q3 | Q4 | R9 | C4 | R11 | C7 | C8 | R10 | C10 | R12 | S3 | IC3 | C9 | S4 | R13 | LED5 | C5 | C1 | C12 | IC1 | S５
_bNames: J3 | J6 | IC2 | J4 | R15 | J2 | J5